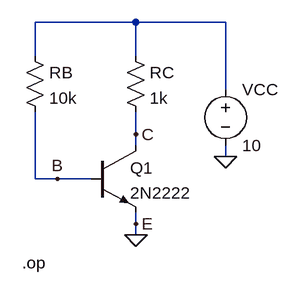
[diagram p0: schematic Draft37.asc]
Draft37.asc, the LTspice schematic file:
Version 4
SHEET 1 880 680
WIRE 176 64 32 64
WIRE 304 64 176 64
WIRE 32 112 32 64
WIRE 176 112 176 64
WIRE 304 160 304 64
WIRE 176 224 176 192
WIRE 176 240 176 224
WIRE 304 256 304 240
WIRE 32 288 32 192
WIRE 64 288 32 288
WIRE 112 288 64 288
WIRE 176 352 176 336
WIRE 176 368 176 352
FLAG 304 256 0
FLAG 176 368 0
FLAG 64 288 B
FLAG 176 224 C
FLAG 176 352 E
SYMBOL res 160 96 R0
SYMATTR InstName RC
SYMATTR Value 1k
SYMBOL res 16 96 R0
SYMATTR InstName RB
SYMATTR Value 10k
SYMBOL npn 112 240 R0
SYMATTR InstName Q1
SYMATTR Value 2N2222
SYMBOL voltage 304 144 R0
SYMATTR InstName VCC
SYMATTR Value 10
TEXT 14 408 Left 2 !.op

The netlist it stands for:
* Draft37.asc
RC N001 C 1k
RB N001 B 10k
Q1 C B 0 0 2N2222
VCC N001 0 10
.model NPN NPN
.model PNP PNP
.lib standard.bjt
.op
.backanno
.end